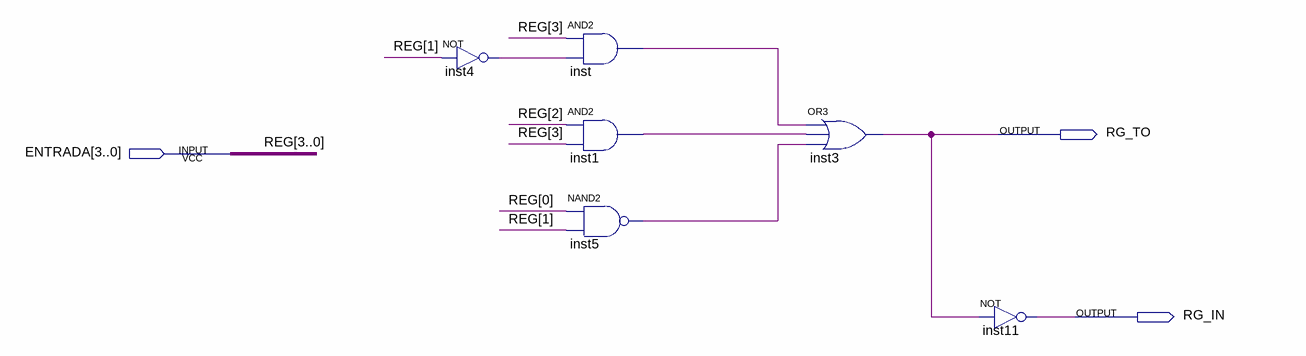
[diagram p0: schematic sheet]
// Quartus schematic escolhe.bdf as structural Verilog: 6 symbols, 3 pins
module escolhe (
  input  [3:0] ENTRADA,
  output RG_TO,
  output RG_IN
);

  wire inst1_out, inst4_out, inst5_out, inst_out;

  not inst4 (inst4_out, ENTRADA[1]);
  and inst (inst_out, ENTRADA[3], inst4_out);
  and inst1 (inst1_out, ENTRADA[2], ENTRADA[3]);
  nand inst5 (inst5_out, ENTRADA[0], ENTRADA[1]);
  or inst3 (RG_TO, inst_out, inst1_out, inst5_out);
  not inst11 (RG_IN, RG_TO);

  // Other names for the same wires on the sheet: REG[3:0] = ENTRADA
endmodule
